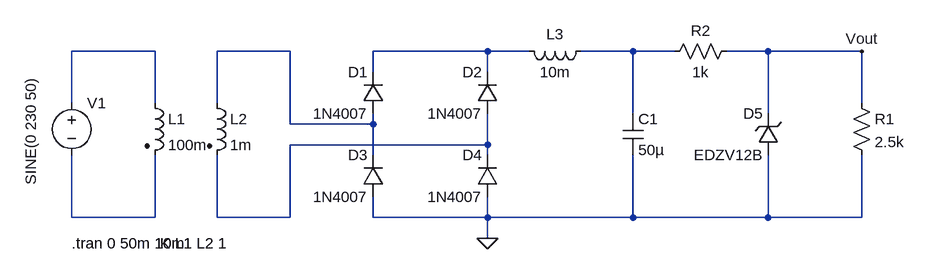
[diagram p0: schematic 2_12VoltPowerSupply.asc]
2_12VoltPowerSupply.asc, the LTspice schematic file:
Version 4
SHEET 1 1272 680
WIRE 112 16 -16 16
WIRE 320 16 208 16
WIRE 624 16 448 16
WIRE 688 16 624 16
WIRE 848 16 768 16
WIRE 912 16 848 16
WIRE 1056 16 992 16
WIRE 1200 16 1056 16
WIRE 448 48 448 16
WIRE 624 48 624 16
WIRE -16 96 -16 16
WIRE 112 96 112 16
WIRE 208 96 208 16
WIRE 1200 96 1200 16
WIRE 848 112 848 16
WIRE 1056 112 1056 16
WIRE 320 128 320 16
WIRE 448 128 448 112
WIRE 448 128 320 128
WIRE 624 160 624 112
WIRE 624 160 320 160
WIRE 448 176 448 128
WIRE 624 176 624 160
WIRE -16 272 -16 176
WIRE 112 272 112 176
WIRE 112 272 -16 272
WIRE 208 272 208 176
WIRE 320 272 320 160
WIRE 320 272 208 272
WIRE 448 272 448 240
WIRE 624 272 624 240
WIRE 624 272 448 272
WIRE 848 272 848 176
WIRE 848 272 624 272
WIRE 1056 272 1056 176
WIRE 1056 272 848 272
WIRE 1200 272 1200 176
WIRE 1200 272 1056 272
WIRE 624 304 624 272
FLAG 624 304 0
FLAG 1200 16 Vout
SYMBOL ind2 96 80 R0
SYMATTR InstName L1
SYMATTR Value 100m
SYMATTR Type ind
SYMATTR SpiceLine Rser=0.01
SYMBOL ind2 192 80 R0
SYMATTR InstName L2
SYMATTR Value 1m
SYMATTR Type ind
SYMATTR SpiceLine Rser=0.01
SYMBOL voltage -16 80 R0
WINDOW 3 -63 -24 VRight 2
WINDOW 123 0 0 Left 0
WINDOW 39 0 0 Left 0
SYMATTR InstName V1
SYMATTR Value SINE(0 230 50)
SYMBOL diode 464 112 R180
WINDOW 0 24 64 Left 2
WINDOW 3 24 0 Left 2
SYMATTR InstName D1
SYMATTR Value 1N4007
SYMBOL diode 640 112 R180
WINDOW 0 24 64 Left 2
WINDOW 3 24 0 Left 2
SYMATTR InstName D2
SYMATTR Value 1N4007
SYMBOL diode 464 240 R180
WINDOW 0 24 64 Left 2
WINDOW 3 24 0 Left 2
SYMATTR InstName D3
SYMATTR Value 1N4007
SYMBOL diode 640 240 R180
WINDOW 0 24 64 Left 2
WINDOW 3 24 0 Left 2
SYMATTR InstName D4
SYMATTR Value 1N4007
SYMBOL cap 832 112 R0
SYMATTR InstName C1
SYMATTR Value 50µ
SYMBOL zener 1072 176 R180
WINDOW 0 24 64 Left 2
WINDOW 3 24 0 Left 2
SYMATTR InstName D5
SYMATTR Value EDZV12B
SYMATTR Description Diode
SYMATTR Type diode
SYMBOL res 1184 80 R0
SYMATTR InstName R1
SYMATTR Value 2.5k
SYMBOL res 1008 0 R90
WINDOW 0 0 56 VBottom 2
WINDOW 3 32 56 VTop 2
SYMATTR InstName R2
SYMATTR Value 1k
SYMBOL ind 784 0 R90
WINDOW 0 5 56 VBottom 2
WINDOW 3 32 56 VTop 2
SYMATTR InstName L3
SYMATTR Value 10m
TEXT 120 312 Left 2 !K L1 L2 1
TEXT -16 312 Left 2 !.tran 0 50m 10m

The netlist it stands for:
* 2_12VoltPowerSupply.asc
L1 N001 N006 100m Rser=0.01
L2 N002 N005 1m Rser=0.01
V1 N001 N006 SINE(0 230 50)
D1 N002 N003 1N4007
D2 N005 N003 1N4007
D3 0 N002 1N4007
D4 0 N005 1N4007
C1 N004 0 50µ
D5 0 Vout EDZV12B
R1 Vout 0 2.5k
R2 Vout N004 1k
L3 N004 N003 10m
.model D D
.lib standard.dio
K L1 L2 1
.tran 0 50m 10m
.backanno
.end